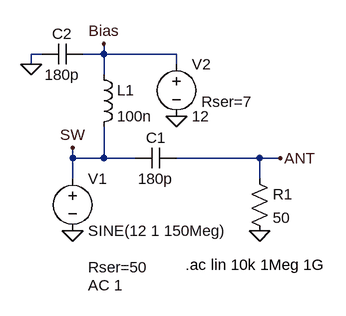
[diagram p0: schematic ac-filter.asc]
ac-filter.asc, the LTspice schematic file:
Version 4
SHEET 1 880 680
WIRE -16 -80 -32 -80
WIRE 80 -80 80 -96
WIRE 80 -80 48 -80
WIRE 192 -80 80 -80
WIRE -32 -64 -32 -80
WIRE 192 -64 192 -80
WIRE 80 -48 80 -80
WIRE 32 80 32 64
WIRE 80 80 80 32
WIRE 80 80 32 80
WIRE 128 80 80 80
WIRE 320 80 192 80
WIRE 352 80 320 80
WIRE 32 112 32 80
WIRE 320 112 320 80
FLAG 32 192 0
FLAG 320 192 0
FLAG 352 80 ANT
FLAG 32 64 SW
FLAG 80 -96 Bias
FLAG -32 -64 0
FLAG 192 16 0
SYMBOL voltage 32 96 R0
WINDOW 123 24 180 Left 2
WINDOW 39 24 152 Left 2
SYMATTR InstName V1
SYMATTR Value SINE(12 1 150Meg)
SYMATTR Value2 AC 1
SYMATTR SpiceLine Rser=50
SYMBOL cap 192 64 R90
WINDOW 0 0 32 VBottom 2
WINDOW 3 32 32 VTop 2
SYMATTR InstName C1
SYMATTR Value 180p
SYMBOL res 304 96 R0
SYMATTR InstName R1
SYMATTR Value 50
SYMBOL ind 64 -64 R0
SYMATTR InstName L1
SYMATTR Value 100n
SYMBOL cap 48 -96 R90
WINDOW 0 0 32 VBottom 2
WINDOW 3 32 32 VTop 2
SYMATTR InstName C2
SYMATTR Value 180p
SYMBOL voltage 192 -80 R0
WINDOW 123 24 180 Left 2
WINDOW 39 38 73 Left 2
SYMATTR InstName V2
SYMATTR Value 12
SYMATTR SpiceLine Rser=7
TEXT 206 244 Left 2 !.ac lin 10k 1Meg 1G

The netlist it stands for:
* ac-filter.asc
V1 SW 0 SINE(12 1 150Meg) AC 1 Rser=50
C1 ANT SW 180p
R1 ANT 0 50
L1 Bias SW 100n
C2 Bias 0 180p
V2 Bias 0 12 Rser=7
.ac lin 10k 1Meg 1G
.backanno
.end

* Results of the author's LTspice run, read from the files saved beside the schematic
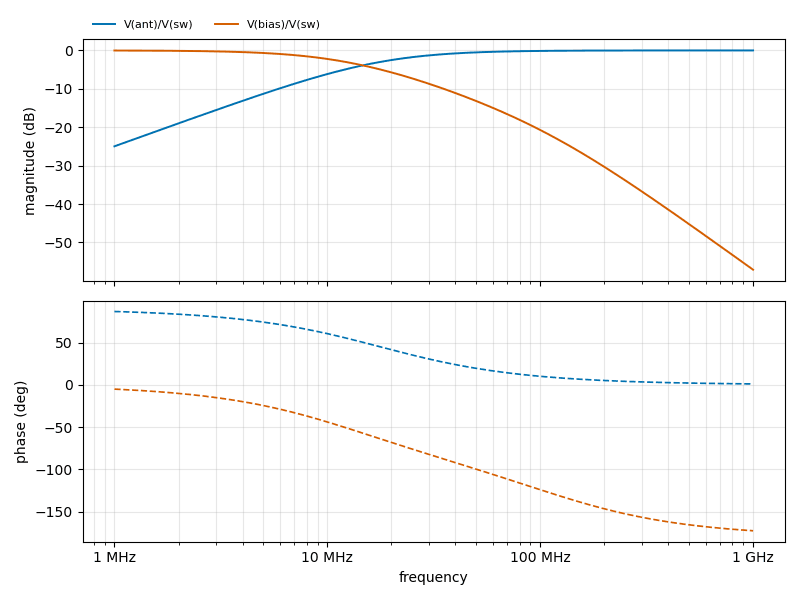
[diagram p1: AC Analysis of ac-filter.asc, plotted from the saved traces]
* AC Analysis, 1 run:
*   V(ant)/V(sw): -24.97 dB at 1 MHz, -0.00 dB at 1 GHz, peak -0.00 dB at 1 GHz, 3 dB below the peak at 17.68 MHz
*   V(bias)/V(sw): -0.03 dB at 1 MHz, -57.09 dB at 1 GHz, peak -0.03 dB at 1 MHz, 3 dB below the peak at 12.29 MHz